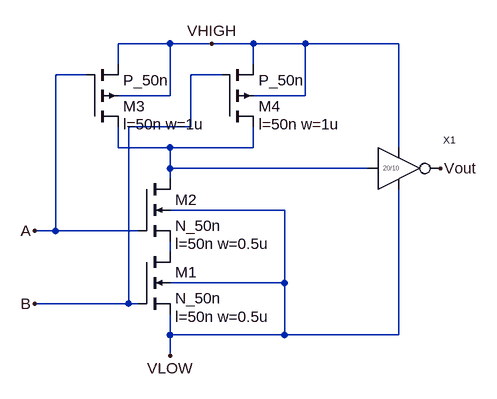
[diagram p0: schematic AND_T.asc]
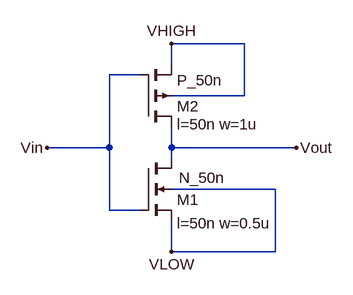
[diagram p1: sub-circuit inverter.asc]
AND_T.asc, the LTspice schematic file:
Version 4
SHEET 1 880 680
WIRE 224 -128 144 -128
WIRE 288 -128 224 -128
WIRE 352 -128 288 -128
WIRE 432 -128 352 -128
WIRE 576 -128 432 -128
WIRE 144 -96 144 -128
WIRE 352 -96 352 -128
WIRE 96 -80 48 -80
WIRE 304 -80 256 -80
WIRE 224 -48 224 -128
WIRE 224 -48 144 -48
WIRE 432 -48 432 -128
WIRE 432 -48 352 -48
WIRE 256 0 256 -80
WIRE 256 0 160 0
WIRE 144 32 144 0
WIRE 224 32 144 32
WIRE 352 32 352 0
WIRE 352 32 224 32
WIRE 576 32 576 -128
WIRE 224 64 224 32
WIRE 528 64 224 64
WIRE 224 80 224 64
WIRE 400 128 224 128
WIRE 48 160 48 -80
WIRE 48 160 16 160
WIRE 176 160 48 160
WIRE 224 192 224 176
WIRE 400 240 400 128
WIRE 400 240 224 240
WIRE 160 272 160 0
WIRE 160 272 16 272
WIRE 176 272 160 272
WIRE 224 320 224 288
WIRE 400 320 400 240
WIRE 400 320 224 320
WIRE 576 320 576 96
WIRE 576 320 400 320
WIRE 224 352 224 320
FLAG 16 160 A
FLAG 16 272 B
FLAG 224 352 VLOW
FLAG 288 -128 VHIGH
FLAG 640 64 Vout
SYMBOL nmos4 176 192 R0
WINDOW 123 56 100 Left 2
SYMATTR Value2 l=50n w=0.5u
SYMATTR InstName M1
SYMATTR Value N_50n
SYMBOL nmos4 176 80 R0
WINDOW 123 56 100 Left 2
SYMATTR Value2 l=50n w=0.5u
SYMATTR InstName M2
SYMATTR Value N_50n
SYMBOL pmos4 304 0 M180
WINDOW 123 56 4 Left 2
SYMATTR Value2 l=50n w=1u
SYMATTR InstName M4
SYMATTR Value P_50n
SYMBOL pmos4 96 0 M180
WINDOW 123 56 4 Left 2
SYMATTR Value2 l=50n w=1u
SYMATTR InstName M3
SYMATTR Value P_50n
SYMBOL Inverter 544 64 R0
SYMATTR InstName X1

inverter.asc, the sub-circuit schematic file:
Version 4
SHEET 1 880 680
WIRE 336 -64 224 -64
WIRE 224 -32 224 -64
WIRE 176 -16 128 -16
WIRE 336 16 336 -64
WIRE 336 16 224 16
WIRE 128 96 128 -16
WIRE 128 96 32 96
WIRE 224 96 224 64
WIRE 416 96 224 96
WIRE 224 112 224 96
WIRE 384 160 224 160
WIRE 128 192 128 96
WIRE 176 192 128 192
WIRE 224 256 224 208
WIRE 384 256 384 160
WIRE 384 256 224 256
FLAG 32 96 Vin
FLAG 224 256 VLOW
FLAG 224 -64 VHIGH
FLAG 416 96 Vout
SYMBOL nmos4 176 112 R0
WINDOW 123 56 100 Left 2
WINDOW 0 56 64 Left 2
WINDOW 3 59 30 Left 2
SYMATTR Value2 l=50n w=0.5u
SYMATTR InstName M1
SYMATTR Value N_50n
SYMBOL pmos4 176 64 M180
WINDOW 123 56 4 Left 2
SYMATTR Value2 l=50n w=1u
SYMATTR InstName M2
SYMATTR Value P_50n

The netlist it stands for:
* AND_T.asc
M1 N002 B VLOW VLOW N_50n l=50n w=0.5u
M2 N001 A N002 VLOW N_50n l=50n w=0.5u
M4 N001 B VHIGH VHIGH P_50n l=50n w=1u
M3 N001 A VHIGH VHIGH P_50n l=50n w=1u
XX1 VHIGH VLOW N001 Vout inverter

* block symbol definitions
.subckt inverter VHIGH VLOW Vin Vout
M1 Vout Vin VLOW VLOW N_50n l=50n w=0.5u
M2 Vout Vin VHIGH VHIGH P_50n l=50n w=1u
.ends inverter

.model NMOS NMOS
.model PMOS PMOS
.lib standard.mos
.backanno
.end